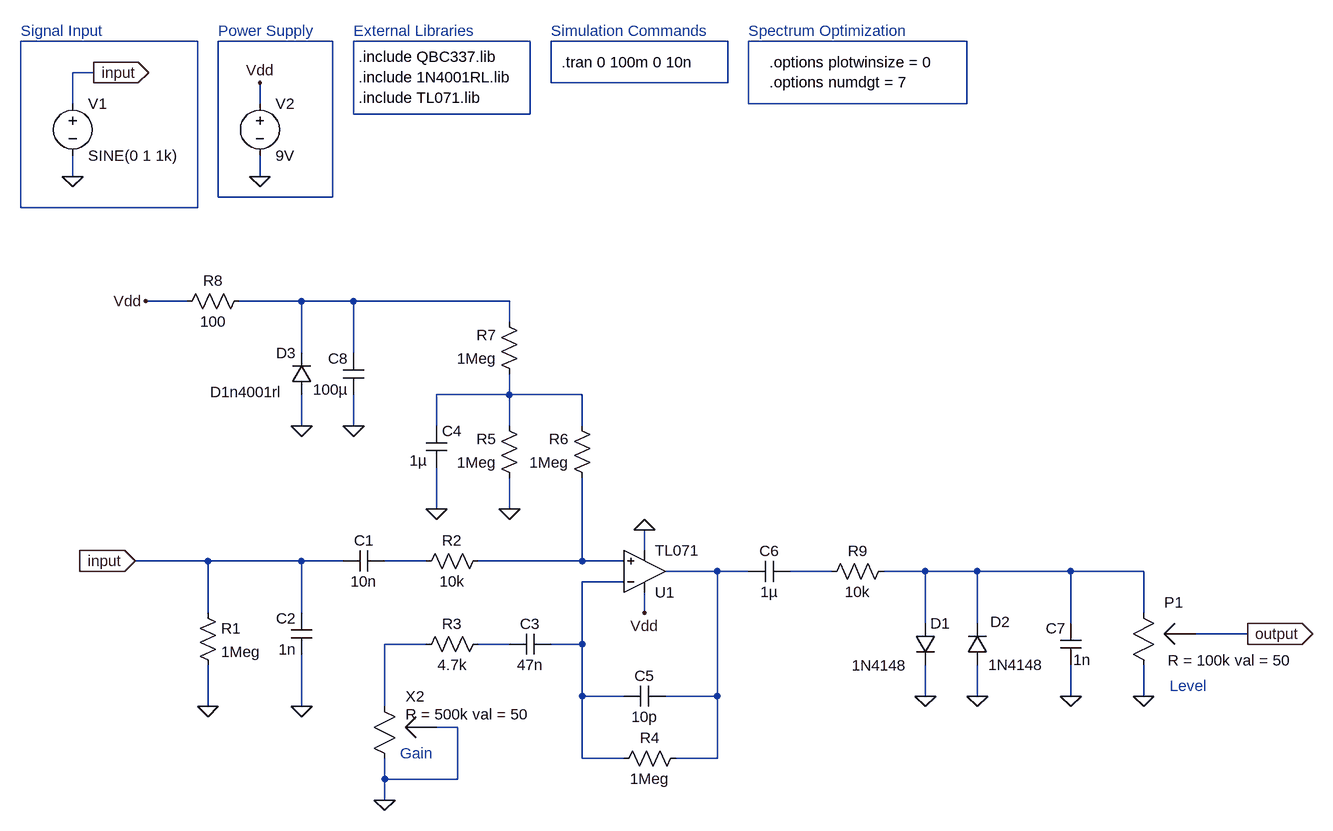
[diagram p0: schematic the_plus_distortion_kit.asc]
the_plus_distortion_kit.asc, the LTspice schematic file:
Version 4
SHEET 1 976 876
WIRE -1184 -400 -1456 -400
WIRE -976 -400 -1152 -400
WIRE -672 -400 -944 -400
WIRE -368 -400 -640 -400
WIRE 0 -400 -336 -400
WIRE -1344 -352 -1376 -352
WIRE -640 -336 -640 -400
WIRE -368 -336 -368 -400
WIRE -368 -336 -640 -336
WIRE -1376 -304 -1376 -352
WIRE -1088 -304 -1088 -336
WIRE -336 -304 -336 -400
WIRE 0 -304 0 -400
WIRE 0 -304 -336 -304
WIRE -944 -288 -944 -400
WIRE -672 -288 -672 -400
WIRE -672 -288 -944 -288
WIRE -1376 -192 -1376 -224
WIRE -1088 -192 -1088 -224
WIRE -1152 -160 -1152 -400
WIRE -976 -160 -976 -400
WIRE -976 -160 -1152 -160
WIRE -1456 -144 -1456 -400
WIRE -1184 -144 -1184 -400
WIRE -1184 -144 -1456 -144
WIRE -1200 0 -1264 0
WIRE -1024 0 -1120 0
WIRE -944 0 -1024 0
WIRE -704 0 -944 0
WIRE -704 32 -704 0
WIRE -1024 80 -1024 0
WIRE -944 80 -944 0
WIRE -704 144 -704 112
WIRE -704 144 -816 144
WIRE -592 144 -704 144
WIRE -1024 192 -1024 144
WIRE -944 192 -944 144
WIRE -816 192 -816 144
WIRE -704 192 -704 144
WIRE -592 192 -592 144
WIRE -816 320 -816 256
WIRE -704 320 -704 272
WIRE -496 384 -496 352
WIRE -1168 400 -1280 400
WIRE -1024 400 -1168 400
WIRE -960 400 -1024 400
WIRE -832 400 -896 400
WIRE -592 400 -592 272
WIRE -592 400 -752 400
WIRE -528 400 -592 400
WIRE -384 416 -464 416
WIRE -336 416 -384 416
WIRE -208 416 -272 416
WIRE -64 416 -128 416
WIRE 16 416 -64 416
WIRE 160 416 16 416
WIRE 272 416 160 416
WIRE -528 432 -592 432
WIRE -1168 480 -1168 400
WIRE -1024 480 -1024 400
WIRE -496 480 -496 448
WIRE 272 480 272 416
WIRE -64 496 -64 416
WIRE 16 496 16 416
WIRE 160 496 160 416
WIRE 432 512 352 512
WIRE -832 528 -896 528
WIRE -704 528 -752 528
WIRE -592 528 -592 432
WIRE -592 528 -640 528
WIRE -592 608 -592 528
WIRE -528 608 -592 608
WIRE -384 608 -384 416
WIRE -384 608 -464 608
WIRE -64 608 -64 560
WIRE 16 608 16 560
WIRE 160 608 160 560
WIRE 272 608 272 560
WIRE -1168 624 -1168 560
WIRE -1024 624 -1024 544
WIRE -896 624 -896 528
WIRE -784 656 -816 656
WIRE -592 704 -592 608
WIRE -528 704 -592 704
WIRE -384 704 -384 608
WIRE -384 704 -448 704
WIRE -896 736 -896 704
WIRE -784 736 -784 656
WIRE -784 736 -896 736
WIRE -896 768 -896 736
FLAG -1376 -192 0
FLAG -1344 -352 input
IOPIN -1344 -352 Out
FLAG -1088 -192 0
FLAG -1088 -336 Vdd
FLAG -496 480 Vdd
FLAG -1280 400 input
IOPIN -1280 400 In
FLAG 432 512 output
IOPIN 432 512 Out
FLAG -496 352 0
FLAG -1024 624 0
FLAG -1168 624 0
FLAG -704 320 0
FLAG -816 320 0
FLAG -1024 192 0
FLAG -944 192 0
FLAG -1264 0 Vdd
FLAG -64 608 0
FLAG 16 608 0
FLAG 160 608 0
FLAG 272 608 0
FLAG -896 768 0
SYMBOL voltage -1376 -320 R0
WINDOW 123 0 0 Left 0
WINDOW 39 0 0 Left 0
SYMATTR InstName V1
SYMATTR Value SINE(0 1 1k)
SYMBOL diode -1008 144 R180
WINDOW 0 24 64 Left 2
WINDOW 3 45 4 Left 2
SYMATTR InstName D3
SYMATTR Value D1n4001rl
SYMBOL voltage -1088 -320 R0
SYMATTR InstName V2
SYMATTR Value 9V
SYMBOL pot 256 464 R0
WINDOW 0 48 0 Left 2
WINDOW 39 53 89 Left 2
SYMATTR InstName P1
SYMATTR SpiceLine R = 100k val = 50
SYMBOL pot -912 608 R0
WINDOW 0 48 0 Left 2
WINDOW 39 48 28 Left 2
SYMATTR InstName X2
SYMATTR SpiceLine R = 500k val = 50
SYMBOL diode 32 560 R180
WINDOW 0 -35 66 Left 2
WINDOW 3 -86 0 Left 2
SYMATTR InstName D2
SYMATTR Value 1N4148
SYMBOL OpAmps\\opamp2 -496 480 M180
SYMATTR InstName U1
SYMATTR Value TL071
SYMBOL res -1184 464 R0
SYMATTR InstName R1
SYMATTR Value 1Meg
SYMBOL cap -896 384 R90
WINDOW 0 0 32 VBottom 2
WINDOW 3 32 32 VTop 2
SYMATTR InstName C1
SYMATTR Value 10n
SYMBOL cap -1008 544 R180
WINDOW 0 24 56 Left 2
WINDOW 3 24 8 Left 2
SYMATTR InstName C2
SYMATTR Value 1n
SYMBOL res -736 384 R90
WINDOW 0 0 56 VBottom 2
WINDOW 3 32 56 VTop 2
SYMATTR InstName R2
SYMATTR Value 10k
SYMBOL res -736 512 R90
WINDOW 0 0 56 VBottom 2
WINDOW 3 32 56 VTop 2
SYMATTR InstName R3
SYMATTR Value 4.7k
SYMBOL cap -640 512 R90
WINDOW 0 0 32 VBottom 2
WINDOW 3 32 32 VTop 2
SYMATTR InstName C3
SYMATTR Value 47n
SYMBOL cap -832 192 R0
WINDOW 3 -26 53 Left 2
SYMATTR InstName C4
SYMATTR Value 1µ
SYMBOL res -432 688 R90
WINDOW 0 0 56 VBottom 2
WINDOW 3 32 56 VTop 2
SYMATTR InstName R4
SYMATTR Value 1Meg
SYMBOL res -688 288 R180
WINDOW 0 36 76 Left 2
WINDOW 3 36 40 Left 2
SYMATTR InstName R5
SYMATTR Value 1Meg
SYMBOL res -576 288 R180
WINDOW 0 36 76 Left 2
WINDOW 3 36 40 Left 2
SYMATTR InstName R6
SYMATTR Value 1Meg
SYMBOL res -688 128 R180
WINDOW 0 36 76 Left 2
WINDOW 3 36 40 Left 2
SYMATTR InstName R7
SYMATTR Value 1Meg
SYMBOL res -1216 16 R270
WINDOW 0 32 56 VTop 2
WINDOW 3 0 56 VBottom 2
SYMATTR InstName R8
SYMATTR Value 100
SYMBOL res -224 432 R270
WINDOW 0 32 56 VTop 2
WINDOW 3 0 56 VBottom 2
SYMATTR InstName R9
SYMATTR Value 10k
SYMBOL cap -464 592 R90
WINDOW 0 0 32 VBottom 2
WINDOW 3 32 32 VTop 2
SYMATTR InstName C5
SYMATTR Value 10p
SYMBOL cap -272 400 R90
WINDOW 0 0 32 VBottom 2
WINDOW 3 32 32 VTop 2
SYMATTR InstName C6
SYMATTR Value 1µ
SYMBOL cap 176 560 R180
WINDOW 0 24 56 Left 2
WINDOW 3 -15 8 Left 2
SYMATTR InstName C7
SYMATTR Value 1n
SYMBOL cap -928 144 R180
WINDOW 0 24 56 Left 2
WINDOW 3 24 8 Left 2
SYMATTR InstName C8
SYMATTR Value 100µ
SYMBOL diode -80 496 R0
WINDOW 3 -97 65 Left 2
SYMATTR InstName D1
SYMATTR Value 1N4148
TEXT -304 -368 Left 2 !.options plotwinsize = 0\n.options numdgt = 7
TEXT -336 -416 Left 2 ;Spectrum Optimization
TEXT -624 -368 Left 2 !.tran 0 100m 0 10n
TEXT -640 -416 Left 2 ;Simulation Commands
TEXT -936 -376 Left 2 !.include QBC337.lib\n.include 1N4001RL.lib\n.include TL071.lib
TEXT -944 -416 Left 2 ;External Libraries
TEXT -1152 -416 Left 2 ;Power Supply
TEXT -1456 -416 Left 2 ;Signal Input
TEXT -872 696 Left 2 ;Gain
TEXT 312 592 Left 2 ;Level

The netlist it stands for:
* the_plus_distortion_kit.asc
V1 input 0 SINE(0 1 1k)
D3 0 N006 D1n4001rl
V2 Vdd 0 9V
XP1 N012 output 0 pot R = 100k val = 50  ; pins 1 2 3
XX2 N014 0 0 pot R = 500k val = 50  ; pins 1 2 3
D2 0 N012 1N4148
XU1 N009 N013 Vdd 0 N010 TL071  ; pins In+ In- V+ V- OUT
R1 input 0 1Meg
C1 N008 input 10n
C2 0 input 1n
R2 N009 N008 10k
R3 N015 N014 4.7k
C3 N013 N015 47n
C4 N007 0 1µ
R4 N010 N013 1Meg
R5 0 N007 1Meg
R6 N009 N007 1Meg
R7 N007 N006 1Meg
R8 Vdd N006 100
R9 N011 N012 10k
C5 N010 N013 10p
C6 N011 N010 1µ
C7 0 N012 1n
C8 0 N006 100µ
D1 N012 0 1N4148
.model D D
.lib standard.dio
.options plotwinsize = 0
.options numdgt = 7
* Spectrum Optimization
.tran 0 100m 0 10n
* Simulation Commands
.include QBC337.lib
.include 1N4001RL.lib
.include TL071.lib
* External Libraries
* Power Supply
* Signal Input
* Gain
* Level
.backanno
.end